# Altium schematic sheet CAN.SchDoc
size A
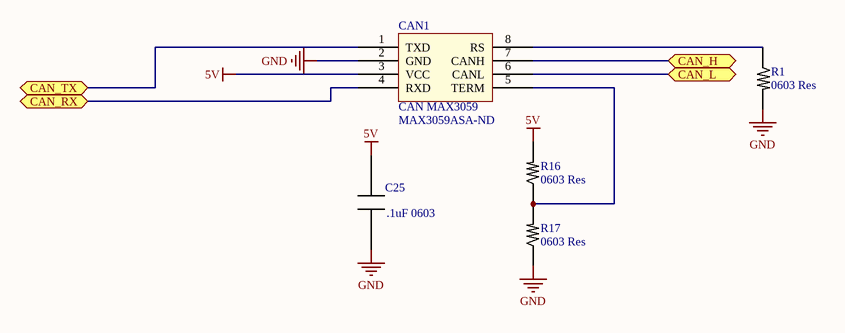
[diagram p0: CAN.SchDoc]

## Parts
C25  .1uF 0603  [0603/1608 SMD Resistor]
CAN1  CAN MAX3059  Supplier Part Number 1: MAX3059ASA-ND  [TJA1040]
R1  0603 Res  [0603/1608 SMD Resistor]
R16  0603 Res  [0603/1608 SMD Resistor]
R17  0603 Res  [0603/1608 SMD Resistor]

## Ports
CAN_H (bidir), CAN_L (bidir), CAN_RX (bidir), CAN_TX (bidir)

## Nets
5V: C25.2 CAN1.3(VCC) R16.2
GND: C25.1 CAN1.2(GND) R1.2 R17.1
CAN_H: CAN1.7(CANH) ; port CAN_H
CAN_L: CAN1.6(CANL) ; port CAN_L
CAN_RX: CAN1.4(RXD) ; port CAN_RX
CAN_TX: CAN1.1(TXD) ; port CAN_TX
NetCAN1_5: CAN1.5(TERM) R16.1 R17.2
NetCAN1_8: CAN1.8(RS) R1.1

## Library data of the parts
C25 = 0603 Cap
CAN1 = CAN MAX3059: Supplier 1: Digi-Key